# EAGLE design relays (EAGLE 8.2.2)
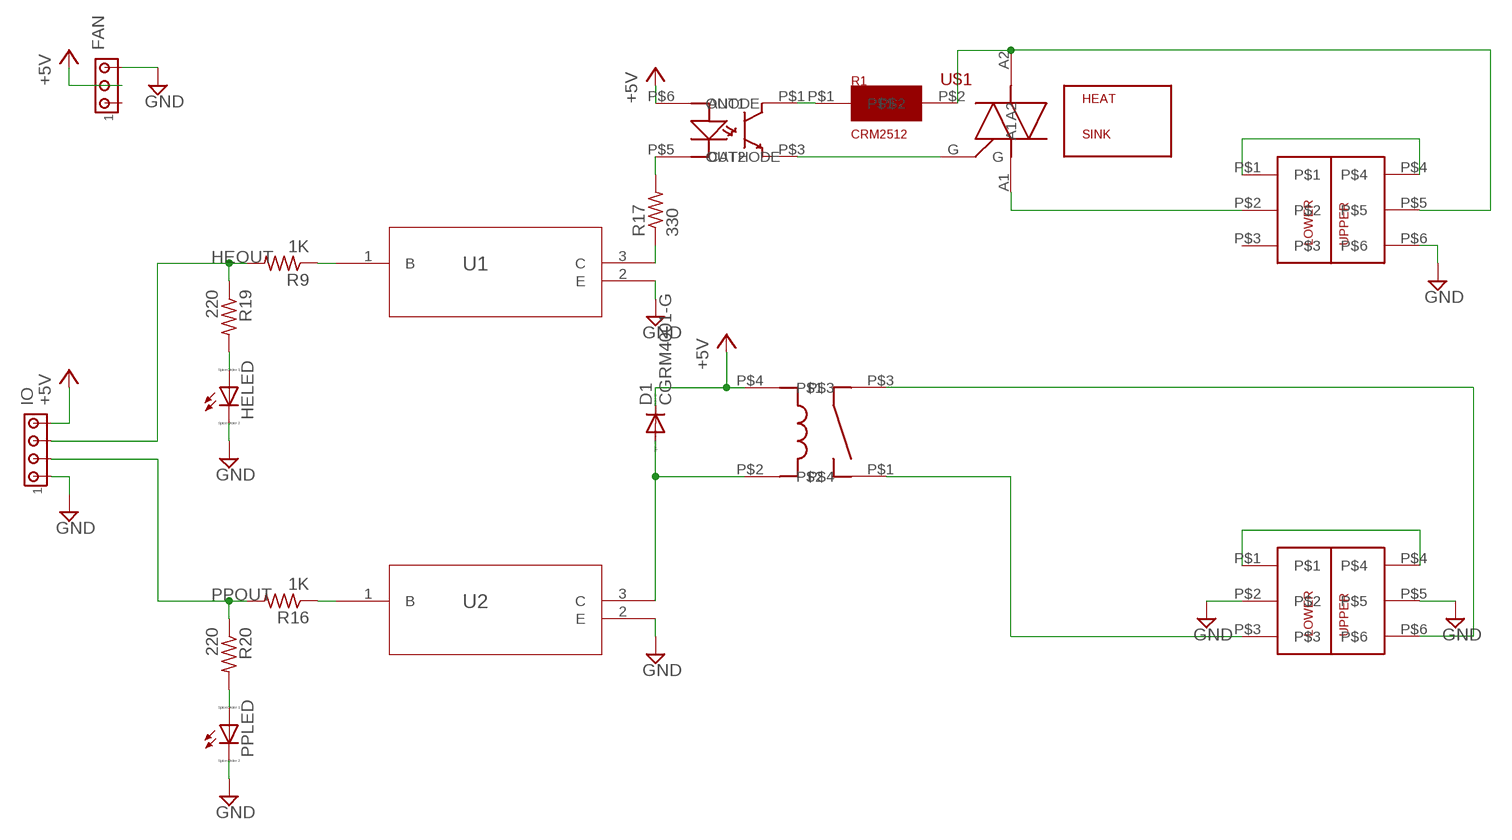
[diagram p0: schematic, sheet 1]

## Parts
D1  CGRM4001-G  [SOD-123_MINI-SMA]
FAN  MTA03-100  [10X03MTA]
HELED  LED_ESML0603  [LED_SML0603]
IO  MTA04-100  [10X04MTA]
PPLED  LED_ESML0603  [LED_SML0603]
R1  CRM2512  [2512(6432METRIC)]
R9  1K  R-US_R0402  [R0402]
R16  1K  R-US_R0402  [R0402]
R17  330  R-US_R1206  [R1206]
R19  220  R-US_R0402  [R0402]
R20  220  R-US_R0402  [R0402]
U1  MMBT2222ALT1G  [SOT-23]
U2  MMBT2222ALT1G  [SOT-23]
U$1  T3050H-6I  [TO-220]
U$2  VM1-038-1AEHORIZONTAL  [VM2-038-1AE]
U$3  G5LE-1A4_DC5  [G5LE-1A4_DC5]
U$4  PC1725041  [PC-MKKDS1.5/3-5.08]
U$5  MOC3020S  [6-SMD]
U$6  PC1719028  [PC-MKKDS5/3-9.5]

## Nets
120H [5A_600V]: U$3.P$1 U$4.P$3
120N [5A_600V]: U$4.P$1 U$4.P$4
+5V: D1.C FAN.2 IO.4 U$3.P$4 U$5.P$6(ANODE)
+120 [30A_600V]: U$6.P$1 U$6.P$4
-120 [30A_600V]: U$1.A1 U$6.P$2
GND: FAN.3 HELED.C IO.1 PPLED.C U1.2(E) U2.2(E) U$4.P$2 U$4.P$5 U$6.P$6
HEOUT: IO.3 R9.2 R19.1
N$13: R17.1 U1.3(C)
N$14: R17.2 U$5.P$5(CATHODE)
N$15: R9.1 U1.1(B)
N$16: R16.1 U2.1(B)
N$18: D1.A U2.3(C) U$3.P$2
N$19 [5A_600V]: U$1.G U$5.P$3(OUT2)
N$20 [5A_600V]: R1.P$1 U$5.P$1(OUT1)
N$22 [30A_600V]: R1.P$2 U$1.A2 U$6.P$5
N$24 [5A_600V]: U$3.P$3 U$4.P$6
N$25: HELED.A R19.2
N$26: PPLED.A R20.2
PPOUT: IO.2 R16.2 R20.1
Unconnected: FAN.1 U$6.P$3

## Library data of the parts
D1 = diode:CGRM400*-G: Molded plasitc,JEDEC SOD-123/Mini SMA Source: Comchip CGRM4001-G.pdf
FAN = con-amp:MTA03-100: AMP connector
HELED PPLED = eagle-ltspice:LED_E: LED Source: http://www.osram.convergy.de Source: www.luxeon.com Source: www.kingbright.com; SPICEMODEL: NONE; SPICEPREFIX: D; SPICETYPE: diode
IO = con-amp:MTA04-100: AMP connector
R1 = digikey:CRM2512
R9 R16 R17 = resistor:R-US_: RESISTOR, American symbol
R19 R20 = rcl:R-US_: RESISTOR, American symbol
U1 U2 = digikey:MMBT2222ALT1G; MANUFACTURER_PART_NUMBER: MMBT2222ALT1G; VENDOR: ON Semiconductor
U$1 = digikey:T3050H-6I
U$2 = digikey:VM1-038-1AE
U$3 = digikey:G5LE-1A4_DC5
U$4 = digikey:PC1725041
U$5 = digikey:MOC3020S
U$6 = digikey:PC1719028

## Net classes
1 5A_600V: width 0.762 mm, clearance 0.508 mm
2 30A_600V: width 7.62 mm, clearance 0.508 mm

## Board
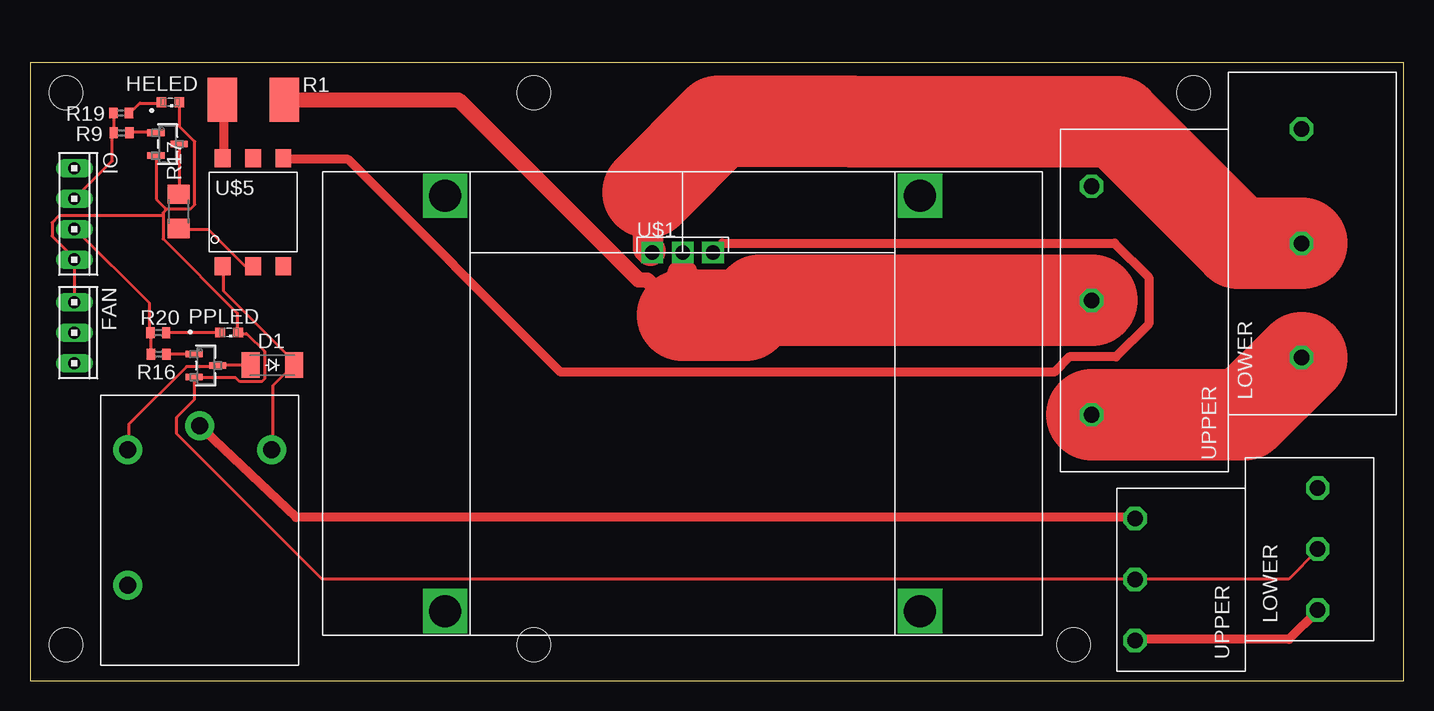
[diagram p1: board, top side]
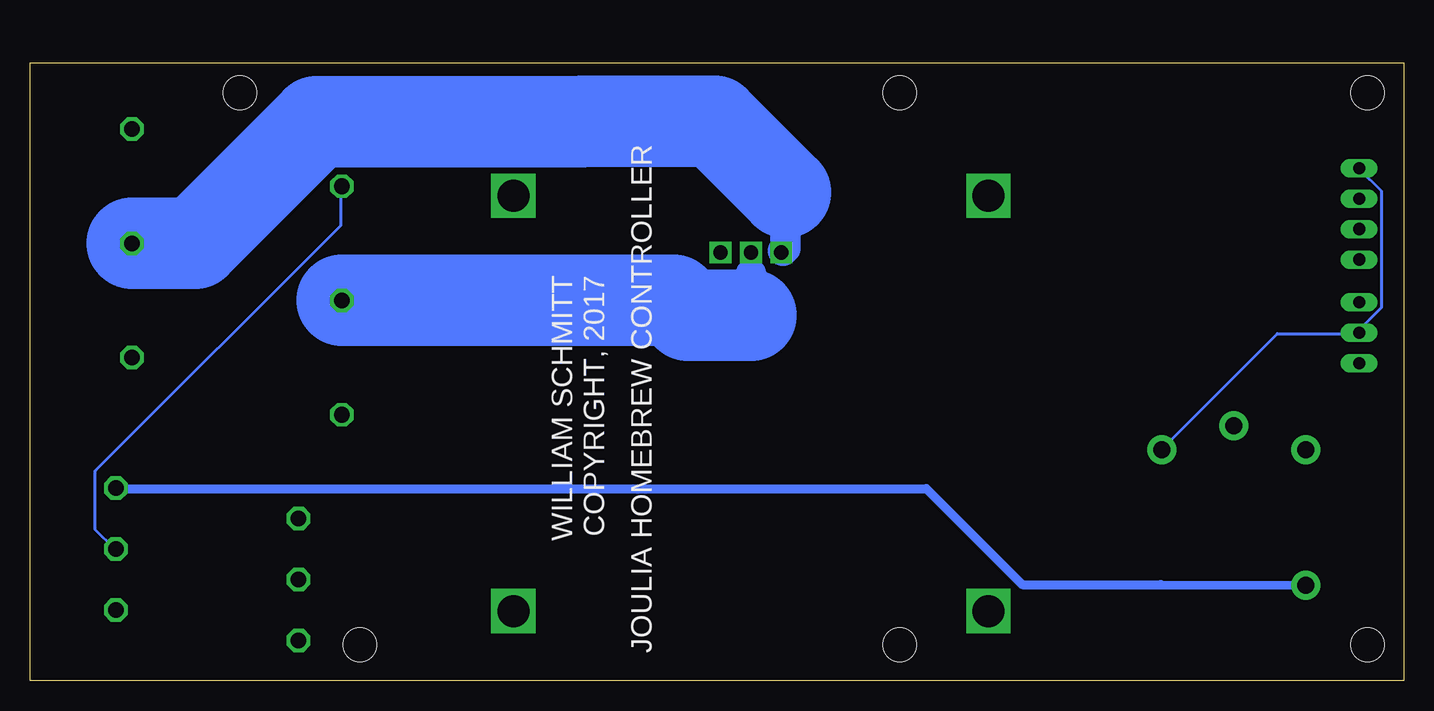
[diagram p2: board, bottom side, seen from below]

Size 114.5 x 51.5 mm. Coordinates in mm from the lower left corner, seen from the top.
Outline: 0,0 114.5,0 114.5,51.5 0,51.5 0,0
Copper layers (1*16): Top 0.035mm / dielectric 1.5mm / Bottom 0.035mm
Design rules "default": minimum track width 10mil, minimum drill 24mil, track to track 8mil, track to pad 8mil, pad to pad 8mil, via to via 8mil, smd to smd 8mil, copper to edge 40mil, drill to drill 8mil, minimum pad ring 10mil, minimum via ring 8mil, stop-mask expansion 4mil, vias tented up to drill 0mil, thermal gap 10mil
Holes 2.8 mm at 3,49 42,49 3,3 42,3 97,49 87,3

### Footprints (pad centres in the part's own frame; a part is rotated, then mirrored left to right if it is on the bottom)
SOD-123_MINI-SMA = smd 1.5 x 2.1: A 1.8,0; C -1.8,0
10X03MTA = drill 1.016 long: 1 2.54,0; 2 0,0; 3 -2.54,0
LED_SML0603 = smd 0.8 x 0.8: A 0.75,0; C -0.75,0
10X04MTA = drill 1.016 long: 1 3.81,0; 2 1.27,0; 3 -1.27,0; 4 -3.81,0
2512(6432METRIC) = smd 2.45 x 3.7: P$1 2.575,0; P$2 -2.575,0
R0402 = smd 0.7 x 0.9: 1 -0.65,0; 2 0.65,0
R1206 = smd 1.6 x 1.803: 1 -1.422,0; 2 1.422,0
SOT-23 = smd 0.559 x 1.422: 1 -0.953,-0.965; 2 0.953,-0.965; 3 0,0.965
TO-220 = drill 1.2 square: A1 -2.54,0; A2 0,0; G 2.54,0
VM2-038-1AE = drill 2.67 square: P$1 10.2,-36.6; P$2 49.8,-36.6; P$3 49.8,-2; P$4 10.2,-2
G5LE-1A4_DC5 = drill 1.4 pad 2.4: P$1 2.25,-15.85; P$2 2.25,-4.55; P$3 8.25,-2.55; P$4 14.25,-4.55
PC-MKKDS1.5/3-5.08 = drill 1.3 octagon: P$1 5.08,4.65; P$2 10.16,4.65; P$3 15.24,4.65; P$4 2.54,19.89; P$5 7.64,19.89; P$6 12.72,19.89
6-SMD = smd 1.3 x 1.5: P$1 -2.54,4.5; P$2 0,4.5; P$3 2.54,4.5; P$4 2.54,-4.5; P$5 0,-4.5; P$6 -2.54,-4.5
PC-MKKDS5/3-9.5 = drill 1.3 octagon: P$1 9.52,7.9; P$2 19.04,7.9; P$3 28.56,7.9; P$4 4.76,25.4; P$5 14.28,25.4; P$6 23.8,25.4

### Placement (x,y rotation side)
D1  20.2,26.3 180 top
FAN  3.7,29 270 top
HELED  11.7,48.2 180 top
IO  3.7,38.9 270 top
PPLED  16.6,29 180 top
R1  18.63,48.41 180 top
R9  7.63,45.65 180 top
R16  10.73,27.2 180 top
R17  12.4,39.1 270 top
R19  7.6,47.3 0 top
R20  10.7,29 0 top
U1  11.46,44.71 270 top
U2  14.66,26.26 270 top
U$1  54.4,35.67 0 top
U$2  24.4,42.4 0 top
U$3  5.9,23.8 0 top
U$4  112,0.8 90 top
U$5  18.6,39.05 0 top
U$6  113.9,17.4 90 top

### Tracks (layer width: path | path; a pad name or v marks a point on that pad's centre or on a via)
120H
  Bottom 0.762: U$3.P$1 20.25,8 31.79,8 39.79,16 107.34,16 U$4.P$3
120N
  Top 0.762: U$4.P$4 92.14,3.43 104.94,3.43 107.34,5.83 U$4.P$1
+5V
  Top 0.254: U$5.P$6 16.13,34.52 16.13,32.46 21.96,26.63 21.96,26.4 22,26.36 D1.C 21.96,26.29 20.25,24.57 20.25,19.32 U$3.P$4
  Bottom 0.254: IO.4 3.67,42.63 1.84,40.8 1.84,31.09 3.67,29.26 3.67,29.03 FAN.2 3.79,28.92 10.53,28.92 20.15,19.3 U$3.P$4
+120
  Top 7.62: U$6.P$4 101.24,22.16 U$6.P$1
-120
  Top 0.254: U$1.A1 51.5,36.03
  Top 2.54: 51.5,40.7 51.5,36.03 51.72,35.81
  Top 7.62: U$6.P$2 100.75,36.44 90.62,46.56 68.54,46.56 68.5,46.6 57.4,46.6 51.5,40.7
  Bottom 2.54: 51.51,40.69 51.51,36.03 51.72,35.81
  Bottom 7.62: U$6.P$2 100.75,36.44 90.62,46.56 68.54,46.56 68.5,46.6 57.42,46.6 51.51,40.69
GND
  Top 0.254: FAN.3 3.67,31.55 3.67,34.98 IO.1 3.67,35.2 1.84,37.03 1.84,38.18 2.42,38.75 11.1,38.75 | 11.33,39.32 13.39,39.32 13.73,39.66 13.73,44.92 12.47,46.18 12.47,48.12 HELED.C | 11.33,39.32 10.53,40.12 10.53,43.66 U1.2 | 11.1,38.75 11.1,38.98 11.33,39.2 11.33,39.32 | 11.1,38.75 11.1,36.8 17.27,30.63 17.27,29.03 PPLED.C 17.37,28.92 18.06,28.92 19.55,27.43 19.55,25.15 19.32,24.92 17.49,24.92 17.14,25.26 13.72,25.26 U2.2 13.72,25.15 13.72,23.43 12.23,21.95 12.23,20.57 24.35,8.46 92.01,8.46 U$4.P$5 92.13,8.46 104.93,8.46 107.33,10.86 U$4.P$2
  Bottom 0.254: U$6.P$6 88.58,41.15 88.58,37.95 109.04,17.49 109.04,12.57 107.44,10.97 U$4.P$2
HEOUT
  Top 0.254: IO.3 3.79,40.23 6.87,43.32 6.87,45.61 R9.2 6.99,45.72 6.99,47.21 6.95,47.24 R19.1
N$13
  Top 0.254: U1.3 12.47,44.69 12.47,40.58 R17.1
N$14
  Top 0.254: U$5.P$5 18.53,34.63 17.85,34.63 14.87,37.6 12.47,37.6 R17.2
N$15
  Top 0.254: R9.1 8.36,45.72 10.42,45.72 U1.1
N$16
  Top 0.254: R16.1 11.45,27.2 13.62,27.2 U2.1
N$18
  Top 0.254: D1.A 18.3,26.29 15.67,26.29 U2.3 15.56,26.18 13.04,26.18 8.24,21.37 8.24,19.32 U$3.P$2
N$19
  Top 0.762: U$5.P$3 21.14,43.43 26.52,43.43 44.23,25.72 85.38,25.72 86.64,26.98 90.53,26.98 93.27,29.72 93.27,33.6 90.41,36.46 57.72,36.46 57.04,35.78 U$1.G
N$20
  Top 0.762: U$5.P$1 16.13,43.55 16.13,48.35 R1.P$1
N$22
  Top 1.27: U$1.A2 54.4,30.46 51.46,33.4 50.72,33.4 35.71,48.41 R1.P$2
  Top 2.54: 54.4,30.46 54.4,33.9
  Top 7.62: U$6.P$5 60.85,31.68 59.63,30.46 54.4,30.46
  Bottom 1.27: 54.4,30.46 U$1.A2
  Bottom 2.54: 54.4,30.46 54.4,33.9
  Bottom 7.62: U$6.P$5 60.85,31.68 59.63,30.46 54.4,30.46
N$24
  Top 0.762: U$3.P$3 14.19,21.14 14.63,20.75 22.18,13.6 92.03,13.6 U$4.P$6
N$25
  Top 0.254: HELED.A 10.87,48.12 9.16,48.12 8.36,47.32 R19.2
N$26
  Top 0.254: PPLED.A 15.79,29.03 11.45,29.03 R20.2
PPOUT
  Top 0.254: R16.2 10.07,28.92 10.05,28.94 R20.1 9.99,29 9.96,29.03 9.96,31.43 3.79,37.6 IO.2

### Text on the board
bNames: JOULIA HOMEBREW CONTROLLER | WILLIAM SCHMITT / COPYRIGHT, 2017